# EAGLE schematic gnat (EAGLE 7.6.0)
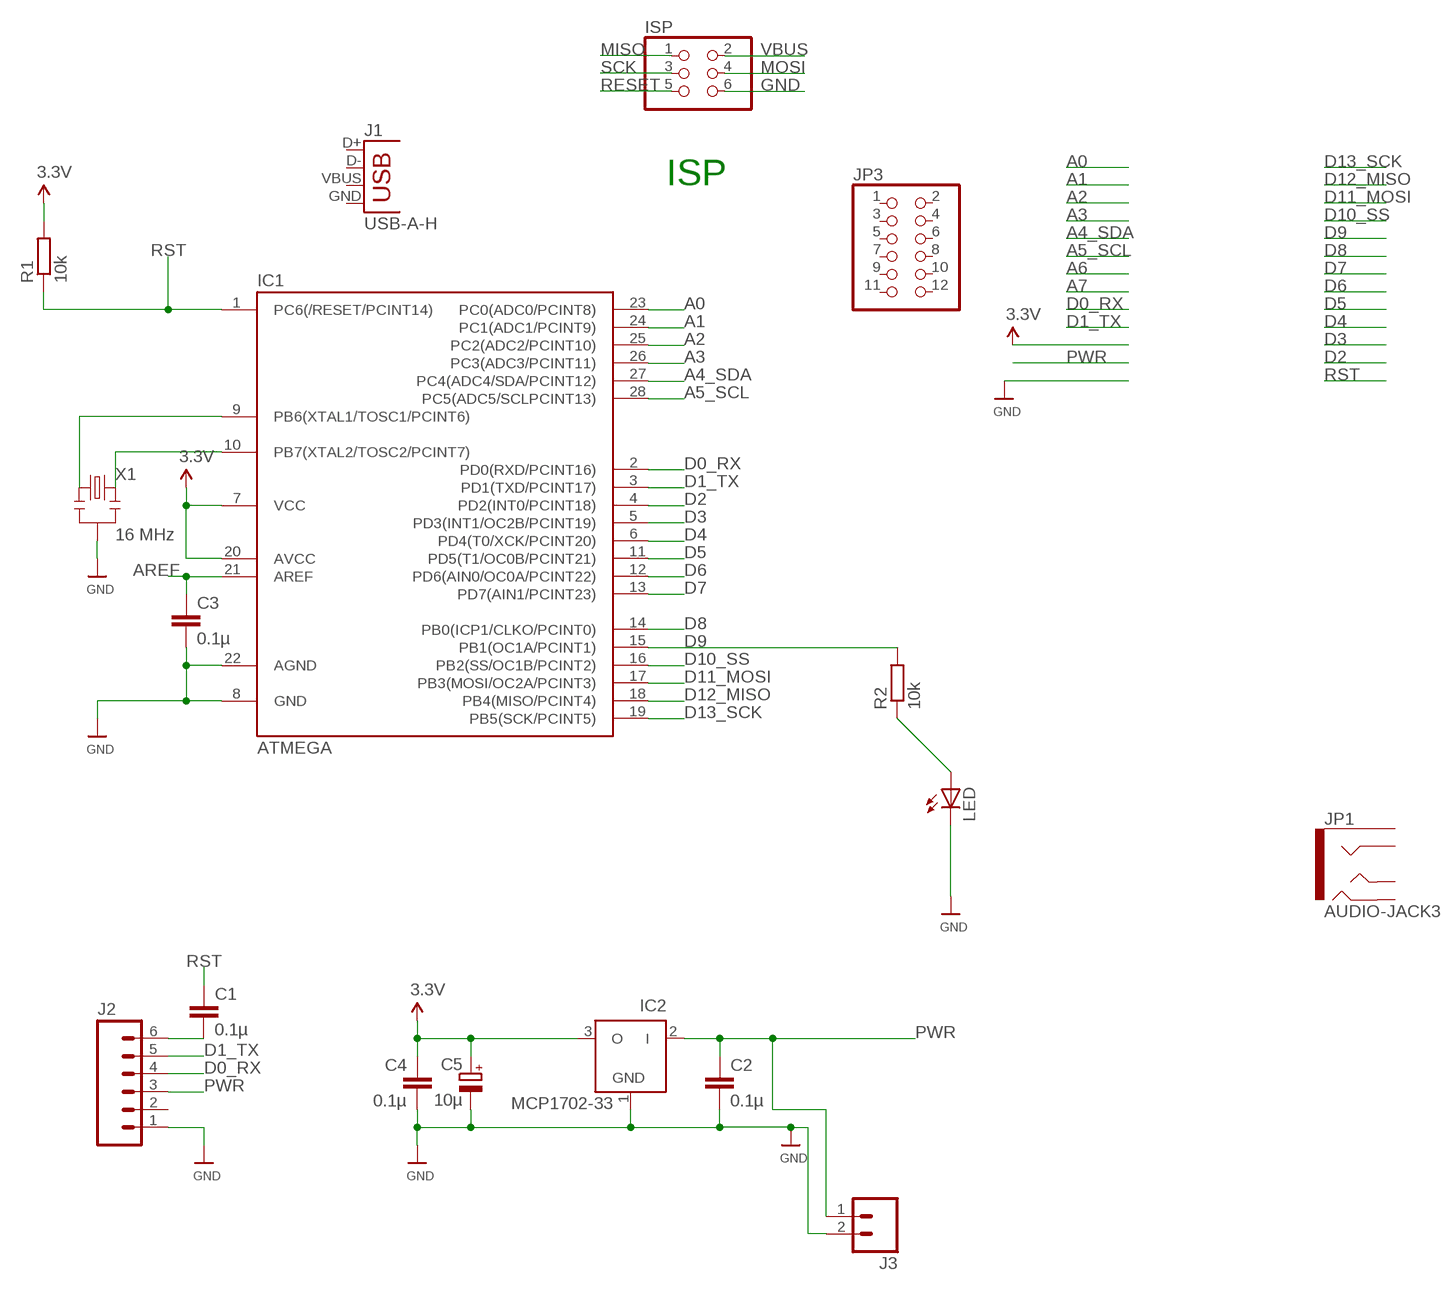
[diagram p0: schematic, sheet 1]

## Parts
C1  0.1µ  C-EU025-024X044  [C025-024X044]
C2  0.1µ  C-EU025-024X044  [C025-024X044]
C3  0.1µ  C-EU025-024X044  [C025-024X044]
C4  0.1µ  C-EU025-024X044  [C025-024X044]
C5  10µ  CPOL-EUE1.8-4  [E1,8-4]
IC1  ATMEGA  ATMEGA48/88/168-PU  [DIL28-3]
IC2  MCP1702-33  MCP1702Z  [TO92]
ISP  PINHD-2X3  [2X03]
J1  USB-A-H  [USB-A-H]
J2  M06SILK_FEMALE_PTH  [1X06]
J3  M02PTH  [1X02]
JP1  AUDIO-JACK3  [AUDIO-JACK-TRRS-SMD]
JP3  PINHD-2X6  [2X06]
LED  LED3MM  [LED3MM]
R1  10k  R-EU_0204/7  [0204/7]
R2  10k  R-EU_0204/7  [0204/7]
X1  16 MHz  RESONATORPTH  [RESONATOR-PTH]

## Nets
A0: IC1.23(PC0(ADC0/PCINT8))
A1: IC1.24(PC1(ADC1/PCINT9))
A2: IC1.25(PC2(ADC2/PCINT10))
A3: IC1.26(PC3(ADC3/PCINT11))
A4_SDA: IC1.27(PC4(ADC4/SDA/PCINT12))
A5_SCL: IC1.28(PC5(ADC5/SCLPCINT13))
AREF: C3.1 IC1.21(AREF)
D0_RX: IC1.2(PD0(RXD/PCINT16)) J2.4
D1_TX: IC1.3(PD1(TXD/PCINT17)) J2.5
D2: IC1.4(PD2(INT0/PCINT18))
D3: IC1.5(PD3(INT1/OC2B/PCINT19))
D4: IC1.6(PD4(T0/XCK/PCINT20))
D5: IC1.11(PD5(T1/OC0B/PCINT21))
D6: IC1.12(PD6(AIN0/OC0A/PCINT22))
D7: IC1.13(PD7(AIN1/PCINT23))
D8: IC1.14(PB0(ICP1/CLKO/PCINT0))
D9: IC1.15(PB1(OC1A/PCINT1)) R2.2
D10_SS: IC1.16(PB2(SS/OC1B/PCINT2))
D11_MOSI: IC1.17(PB3(MOSI/OC2A/PCINT3))
D12_MISO: IC1.18(PB4(MISO/PCINT4))
D13_SCK: IC1.19(PB5(SCK/PCINT5))
GND [power]: C2.2 C3.2 C4.2 C5.- IC1.8(GND) IC1.22(AGND) IC2.1(GND) ISP.6 J2.1 J3.2 LED.K(C) X1.2
MISO: ISP.1
MOSI: ISP.4
N$1: IC1.9(PB6(XTAL1/TOSC1/PCINT6)) X1.1
N$2: LED.A R2.1
N$20: C1.2 J2.6
N$21: IC1.10(PB7(XTAL2/TOSC2/PCINT7)) X1.3
PWR [power]: C2.1 IC2.2(I) J2.3 J3.1
RESET: ISP.5
RST: C1.1 IC1.1(PC6(/RESET/PCINT14)) R1.1
SCK: ISP.3
VBUS [power]: ISP.2
VCC [power]: C4.1 C5.+ IC1.7(VCC) IC1.20(AVCC) IC2.3(O) R1.2 ; supply symbol labelled 3.3V
Unconnected: J1.D+ J1.D- J1.GND J1.VBUS J2.2 JP1.EARTH JP1.RING1 JP1.RING2 JP1.TIP JP3.1 JP3.2 JP3.3 JP3.4 JP3.5 JP3.6 JP3.7 JP3.8 JP3.9 JP3.10 JP3.11 JP3.12

## Notes on the sheet
- ISP

## Library data of the parts
C1-C4 = resistor:C-EU: CAPACITOR, European symbol
C5 = resistor:CPOL-EU: POLARIZED CAPACITOR, European symbol
IC1 = atmega8:ATMEGA48/88/168-PU
IC2 = JeeLabs:MCP1702: 200 mA, Low Power Low Dropout Voltage Regulator
ISP = pinhead:PINHD-2X3: PIN HEADER
J1 = SparkFun-Connectors:USB: USB Connectors USB-B-PTH is fully proven SKU : PRT-00139/CONN-08278 USB-miniB is fully proven SKU : PRT-00587 USB-A-PCB is untested. USB-A-H is throughly reviewed, but untested. Spark Fun Electronics SKU : PRT-00437 USB-B-SMT is throughly reviewed, but untested. Needs silkscreen touching up. USB-A-S has not been used/tested USB-MB-H has not been used/tested USB-MICROB has been used. CONN-09505; PROD_ID: CONN-08367
J2 = SparkFun-Connectors:M06: Header 6 Standard 6-pin 0.1" header. Use with straight break away headers (SKU : PRT-00116), right angle break away headers (PRT-00553), swiss pins (PRT-00743), machine pins (PRT-00117), and female headers (PRT-00115). Molex polarized connector foot print use with SKU : PRT-08094 with associated crimp pins and housings. NOTES ON THE VARIANTS LOCK and LOCK_LONGPADS... This footprint was designed to help hold the alignment of a through-hole component (i.e. 6-pin header) while soldering it into place. You may notice that each hole has been shifted either up or down by 0.005 of an inch from it's more standard position (which is a perfectly straight line). This slight alteration caused the pins (the squares in the middle) to touch the edges of the holes. Because they are alternating, it causes a "brace" to hold the component in place. 0.005 has proven to be the perfect amount of "off-center" position when using our standard breakaway headers. Although looks a little odd when you look at the bare footprint, once you have a header in there, the alteration is very hard to notice. Also,if you push a header all the way into place, it is covered up entirely on the bottom side. This idea of altering the position of holes to aid alignment will be further integrated into the Sparkfun Library for other footprints. It can help hold any component with 3 or more connection pins.; PROD_ID: CONN-08437
J3 = SparkFun-Connectors:M02: Standard 2-pin 0.1" header. Use with - straight break away headers ( PRT-00116) - right angle break away headers (PRT-00553) - swiss pins (PRT-00743) - machine pins (PRT-00117) - female headers (PRT-00115) Molex polarized connector foot print use with: PRT-08233 with associated crimp pins and housings. 2.54_SCREWTERM for use with PRT-10571. 3.5mm Screw Terminal footprints for PRT-08084 5mm Screw Terminal footprints for use with PRT-08432
JP1 = SparkFun-Connectors:AUDIO-JACK3: Audio jack - 3.5mm TRRS variety - two rings.
JP3 = pinhead:PINHD-2X6: PIN HEADER
LED = led:LED: LED OSRAM: - CHIPLED LG R971, LG N971, LY N971, LG Q971, LY Q971, LO R971, LY R971 LH N974, LH R974 LS Q976, LO Q976, LY Q976 LO Q996 - Hyper CHIPLED LW Q18S LB Q993, LB Q99A, LB R99A - SideLED LS A670, LO A670, LY A670, LG A670, LP A670 LB A673, LV A673, LT A673, LW A673 LH A674 LY A675 LS A676, LA A676, LO A676, LY A676, LW A676 LS A679, LY A679, LG A679 - Hyper Micro SIDELED® LS Y876, LA Y876, LO Y876, LY Y876 LT Y87S - SmartLED LW L88C, LW L88S LB L89C, LB L89S, LG L890 LS L89K, LO L89K, LY L89K LS L896, LA L896, LO L896, LY L896 - TOPLED LS T670, LO T670, LY T670, LG T670, LP T670 LSG T670, LSP T670, LSY T670, LOP T670, LYG T670 LG T671, LOG T671, LSG T671 LB T673, LV T673, LT T673, LW T673 LH T674 LS T676, LA T676, LO T676, LY T676, LB T676, LH T676, LSB T676, LW T676 LB T67C, LV T67C, LT T67C, LS T67K, LO T67K, LY T67K, LW E67C LS E67B, LA E67B, LO E67B, LY E67B, LB E67C, LV E67C, LT E67C LW T67C LS T679, LY T679, LG T679 LS T770, LO T770, LY T770, LG T770, LP T770 LB T773, LV T773, LT T773, LW T773 LH T774 LS E675, LA E675, LY E675, LS T675 LS T776, LA T776, LO T776, LY T776, LB T776 LHGB T686 LT T68C, LB T68C - Hyper Mini TOPLED® LB M676 - Mini TOPLED Santana® LG M470 LS M47K, LO M47K, LY M47K Source: http://www.osram.convergy.de LUXEON: - LUMILED® LXK2-PW12-R00, LXK2-PW12-S00, LXK2-PW14-U00, LXK2-PW14-V00 LXK2-PM12-R00, LXK2-PM12-S00, LXK2-PM14-U00 LXK2-PE12-Q00, LXK2-PE12-R00, LXK2-PE12-S00, LXK2-PE14-T00, LXK2-PE14-U00 LXK2-PB12-K00, LXK2-PB12-L00, LXK2-PB12-M00, LXK2-PB14-N00, LXK2-PB14-P00, LXK2-PB14-Q00 LXK2-PR12-L00, LXK2-PR12-M00, LXK2-PR14-Q00, LXK2-PR14-R00 LXK2-PD12-Q00, LXK2-PD12-R00, LXK2-PD12-S00 LXK2-PH12-R00, LXK2-PH12-S00 LXK2-PL12-P00, LXK2-PL12-Q00, LXK2-PL12-R00 Source: www.luxeon.com KINGBRIGHT: KA-3528ASYC Source: www.kingbright.com
R1 R2 = resistor:R-EU_: RESISTOR, European symbol
X1 = SparkFun:RESONATOR: Resonator Small SMD resonator. This is the itty bitty 10/20MHz resonators with built in caps. CSTCE10M0G55 and CSTCE20M0V53. Footprint has been reviewed closely but hasn't been tested yet.

## Net classes
1 power: width 0.305 mm